# Altium schematic sheet power_supply.SchDoc
size A2
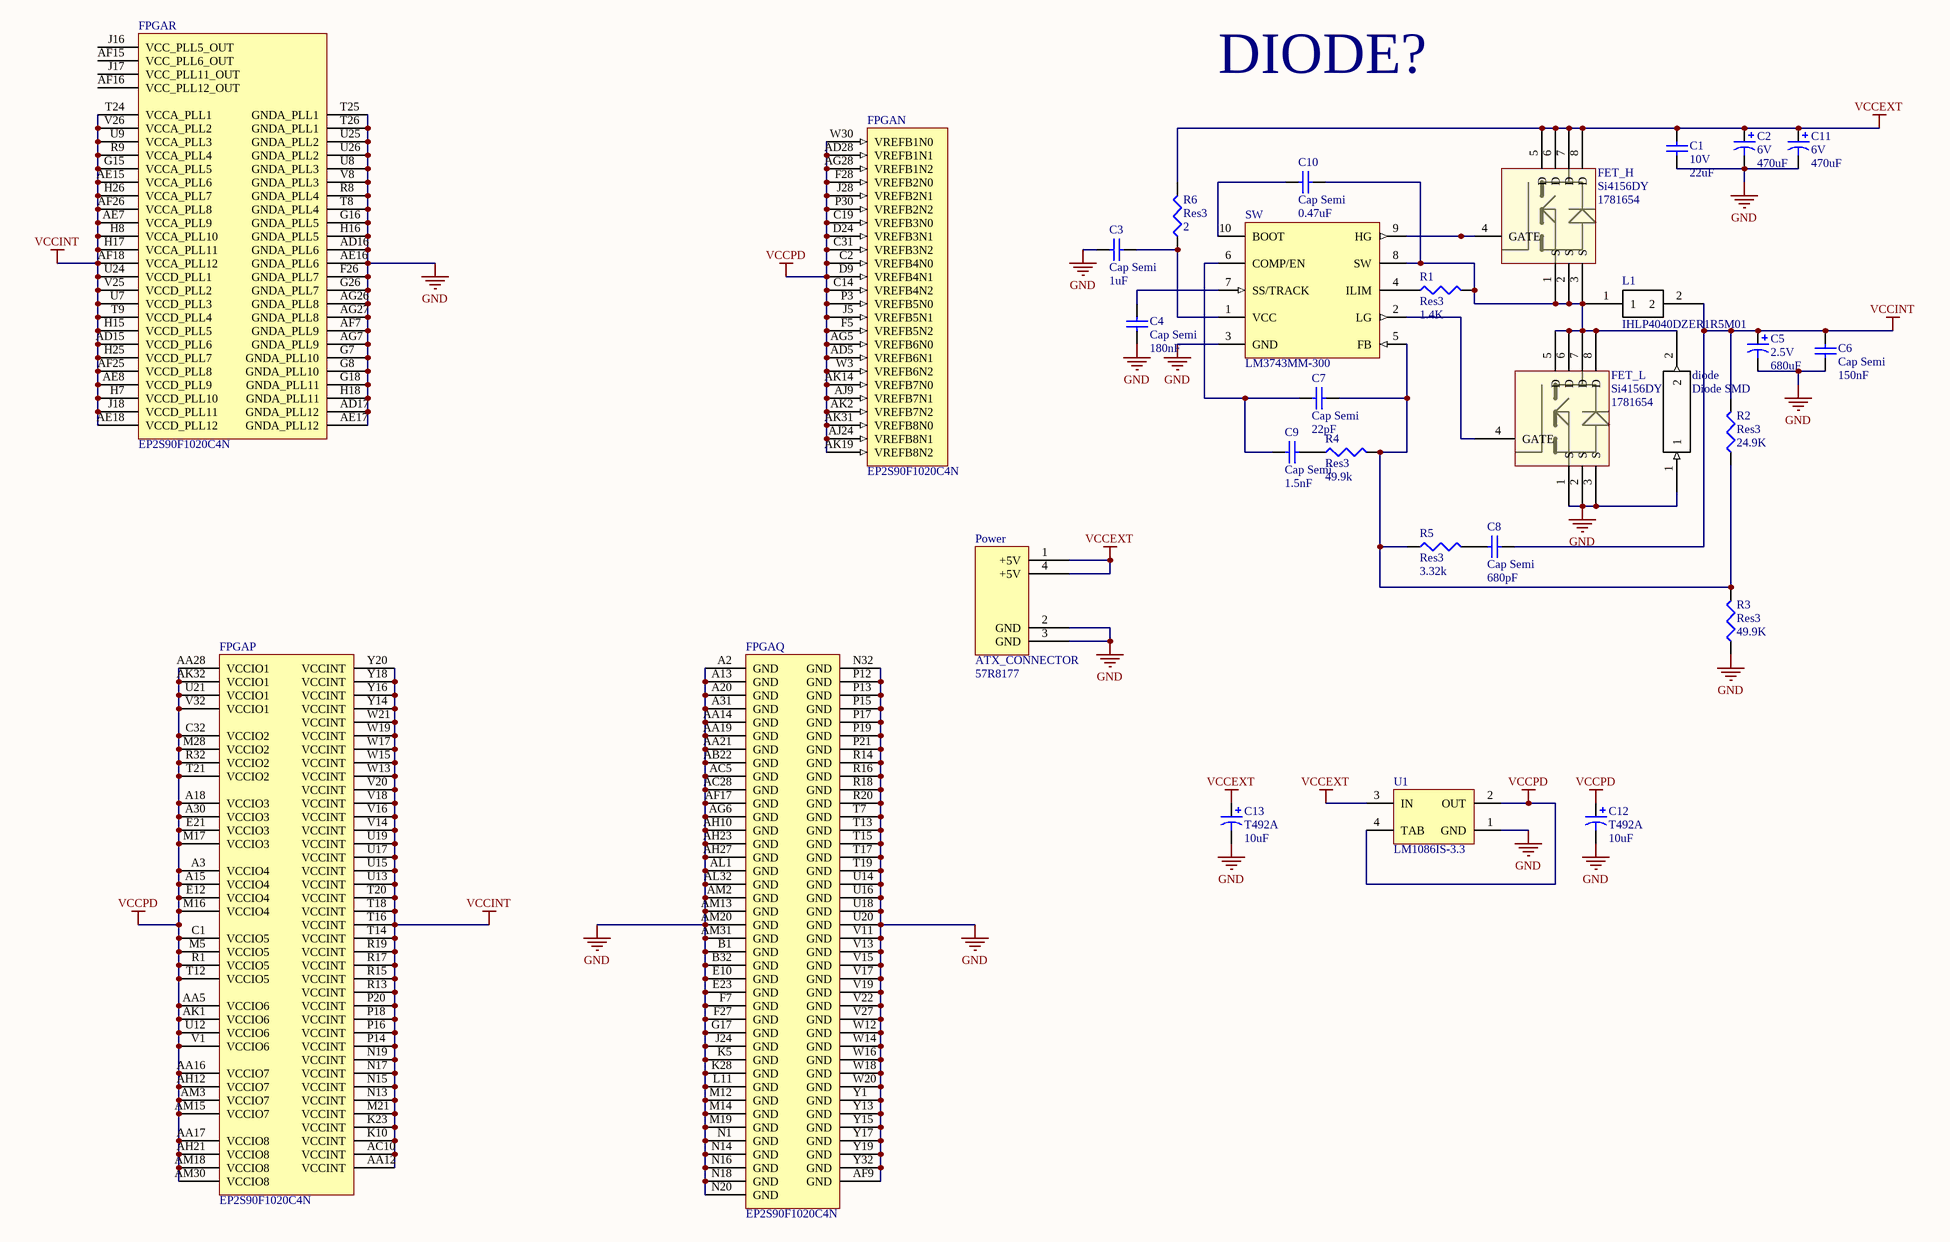
[diagram p0: power_supply.SchDoc]

## Parts
C1  10V  value 22uF  [CAPC3225L]
C2  6V  value 470uF  [E]
C3  Cap Semi  value 1uF  [2012[0805]]
C4  Cap Semi  value 180nF  [2012[0805]]
C5  2.5V  value 680uF  [E]
C6  Cap Semi  value 150nF  [2012[0805]]
C7  Cap Semi  value 22pF  [CAPC1608L]
C8  Cap Semi  value 680pF  [CAPC1608L]
C9  Cap Semi  value 1.5nF  [CAPC1608L]
C10  Cap Semi  value 0.47uF  [2012[0805]]
C11  6V  value 470uF  [E]
C12  T492A  value 10uF  [A]
C13  T492A  value 10uF  [A]
diode  Diode SMD  [Diode SMD]
FET_H  Si4156DY  Supplier Part Number 1: 1781654  [SO-8C_M]
FET_L  Si4156DY  Supplier Part Number 1: 1781654  [SO-8C_M]
FPGA  EP2S90F1020C4N  [FBGA1020]  (parts N,P,Q,R of 18)
L1  IHLP4040DZER1R5M01  [IHLP4040DZER1R5M01]
Power  ATX_CONNECTOR  Supplier Part Number 1: 57R8177  [Molex 8981]
R1  Res3  value 1.4K  [RESC1608L]
R2  Res3  value 24.9K  [RESC1608L]
R3  Res3  value 49.9K  [RESC1608L]
R4  Res3  value 49.9k  [RESC1608L]
R5  Res3  value 3.32k  [RESC1608L]
R6  Res3  value 2  [RESC1608L]
SW  LM3743MM-300  [MUB10A_N]
U1  LM1086IS-3.3  [TS3B_N]

## Nets
GND: C1.2 C2.2 C3.2 C4.1 C5.2 C6.1 C11.2 C12.2 C13.2 diode.1 FET_L.1(S) FET_L.2(S) FET_L.3(S) FPGA.A2(GND) FPGA.A13(GND) FPGA.A20(GND) FPGA.A31(GND) FPGA.AA14(GND) FPGA.AA19(GND) FPGA.AA21(GND) FPGA.AB22(GND) FPGA.AC5(GND) FPGA.AC28(GND) FPGA.AD16(GNDA_PLL6) FPGA.AD17(GNDA_PLL12) FPGA.AE16(GNDA_PLL6) FPGA.AE17(GNDA_PLL12) FPGA.AF7(GNDA_PLL9) FPGA.AF9(GND) FPGA.AF17(GND) FPGA.AG6(GND) FPGA.AG7(GNDA_PLL9) FPGA.AG26(GNDA_PLL8) FPGA.AG27(GNDA_PLL8) FPGA.AH10(GND) FPGA.AH23(GND) FPGA.AH27(GND) FPGA.AL1(GND) FPGA.AL32(GND) FPGA.AM2(GND) FPGA.AM13(GND) FPGA.AM20(GND) FPGA.AM31(GND) FPGA.B1(GND) FPGA.B32(GND) FPGA.E10(GND) FPGA.E23(GND) FPGA.F7(GND) FPGA.F26(GNDA_PLL7) FPGA.F27(GND) FPGA.G7(GNDA_PLL10) FPGA.G8(GNDA_PLL10) FPGA.G16(GNDA_PLL5) FPGA.G17(GND) FPGA.G18(GNDA_PLL11) FPGA.G26(GNDA_PLL7) FPGA.H16(GNDA_PLL5) FPGA.H18(GNDA_PLL11) FPGA.J24(GND) FPGA.K5(GND) FPGA.K28(GND) FPGA.L11(GND) FPGA.M12(GND) FPGA.M14(GND) FPGA.M19(GND) FPGA.N1(GND) FPGA.N14(GND) FPGA.N16(GND) FPGA.N18(GND) FPGA.N20(GND) FPGA.N32(GND) FPGA.P12(GND) FPGA.P13(GND) FPGA.P15(GND) FPGA.P17(GND) FPGA.P19(GND) FPGA.P21(GND) FPGA.R8(GNDA_PLL4) FPGA.R14(GND) FPGA.R16(GND) FPGA.R18(GND) FPGA.R20(GND) FPGA.T7(GND) FPGA.T8(GNDA_PLL4) FPGA.T13(GND) FPGA.T15(GND) FPGA.T17(GND) FPGA.T19(GND) FPGA.T25(GNDA_PLL1) FPGA.T26(GNDA_PLL1) FPGA.U8(GNDA_PLL3) FPGA.U14(GND) FPGA.U16(GND) FPGA.U18(GND) FPGA.U20(GND) FPGA.U25(GNDA_PLL2) FPGA.U26(GNDA_PLL2) FPGA.V8(GNDA_PLL3) FPGA.V11(GND) FPGA.V13(GND) FPGA.V15(GND) FPGA.V17(GND) FPGA.V19(GND) FPGA.V22(GND) FPGA.V27(GND) FPGA.W12(GND) FPGA.W14(GND) FPGA.W16(GND) FPGA.W18(GND) FPGA.W20(GND) FPGA.Y1(GND) FPGA.Y13(GND) FPGA.Y15(GND) FPGA.Y17(GND) FPGA.Y19(GND) FPGA.Y32(GND) Power.2(GND) Power.3(GND) R3.1 SW.3(GND) U1.1(GND)
VCCEXT: C1.1 C2.1 C11.1 C13.1 FET_H.5(D) FET_H.6(D) FET_H.7(D) FET_H.8(D) Power.1(+5V) Power.4(+5V) R6.2 U1.3(IN)
VCCINT: C5.1 C6.2 C8.1 FPGA.AA12(VCCINT) FPGA.AC10(VCCINT) FPGA.AD15(VCCD_PLL6) FPGA.AE7(VCCA_PLL9) FPGA.AE8(VCCD_PLL9) FPGA.AE15(VCCA_PLL6) FPGA.AE18(VCCD_PLL12) FPGA.AF18(VCCA_PLL12) FPGA.AF25(VCCD_PLL8) FPGA.AF26(VCCA_PLL8) FPGA.G15(VCCA_PLL5) FPGA.H7(VCCD_PLL10) FPGA.H8(VCCA_PLL10) FPGA.H15(VCCD_PLL5) FPGA.H17(VCCA_PLL11) FPGA.H25(VCCD_PLL7) FPGA.H26(VCCA_PLL7) FPGA.J18(VCCD_PLL11) FPGA.K10(VCCINT) FPGA.K23(VCCINT) FPGA.M21(VCCINT) FPGA.N13(VCCINT) FPGA.N15(VCCINT) FPGA.N17(VCCINT) FPGA.N19(VCCINT) FPGA.P14(VCCINT) FPGA.P16(VCCINT) FPGA.P18(VCCINT) FPGA.P20(VCCINT) FPGA.R9(VCCA_PLL4) FPGA.R13(VCCINT) FPGA.R15(VCCINT) FPGA.R17(VCCINT) FPGA.R19(VCCINT) FPGA.T9(VCCD_PLL4) FPGA.T14(VCCINT) FPGA.T16(VCCINT) FPGA.T18(VCCINT) FPGA.T20(VCCINT) FPGA.T24(VCCA_PLL1) FPGA.U7(VCCD_PLL3) FPGA.U9(VCCA_PLL3) FPGA.U13(VCCINT) FPGA.U15(VCCINT) FPGA.U17(VCCINT) FPGA.U19(VCCINT) FPGA.U24(VCCD_PLL1) FPGA.V14(VCCINT) FPGA.V16(VCCINT) FPGA.V18(VCCINT) FPGA.V20(VCCINT) FPGA.V25(VCCD_PLL2) FPGA.V26(VCCA_PLL2) FPGA.W13(VCCINT) FPGA.W15(VCCINT) FPGA.W17(VCCINT) FPGA.W19(VCCINT) FPGA.W21(VCCINT) FPGA.Y14(VCCINT) FPGA.Y16(VCCINT) FPGA.Y18(VCCINT) FPGA.Y20(VCCINT) L1.2 R2.2
VCCPD: C12.1 FPGA.A3(VCCIO4) FPGA.A15(VCCIO4) FPGA.A18(VCCIO3) FPGA.A30(VCCIO3) FPGA.AA5(VCCIO6) FPGA.AA16(VCCIO7) FPGA.AA17(VCCIO8) FPGA.AA28(VCCIO1) FPGA.AD5(VREFB6N1) FPGA.AD28(VREFB1N1) FPGA.AG5(VREFB6N0) FPGA.AG28(VREFB1N2) FPGA.AH12(VCCIO7) FPGA.AH21(VCCIO8) FPGA.AJ9(VREFB7N1) FPGA.AJ24(VREFB8N1) FPGA.AK1(VCCIO6) FPGA.AK2(VREFB7N2) FPGA.AK14(VREFB7N0) FPGA.AK19(VREFB8N2) FPGA.AK31(VREFB8N0) FPGA.AK32(VCCIO1) FPGA.AM3(VCCIO7) FPGA.AM15(VCCIO7) FPGA.AM18(VCCIO8) FPGA.AM30(VCCIO8) FPGA.C1(VCCIO5) FPGA.C2(VREFB4N0) FPGA.C14(VREFB4N2) FPGA.C19(VREFB3N0) FPGA.C31(VREFB3N2) FPGA.C32(VCCIO2) FPGA.D9(VREFB4N1) FPGA.D24(VREFB3N1) FPGA.E12(VCCIO4) FPGA.E21(VCCIO3) FPGA.F5(VREFB5N2) FPGA.F28(VREFB2N0) FPGA.J5(VREFB5N1) FPGA.J28(VREFB2N1) FPGA.M5(VCCIO5) FPGA.M16(VCCIO4) FPGA.M17(VCCIO3) FPGA.M28(VCCIO2) FPGA.P3(VREFB5N0) FPGA.P30(VREFB2N2) FPGA.R1(VCCIO5) FPGA.R32(VCCIO2) FPGA.T12(VCCIO5) FPGA.T21(VCCIO2) FPGA.U12(VCCIO6) FPGA.U21(VCCIO1) FPGA.V1(VCCIO6) FPGA.V32(VCCIO1) FPGA.W3(VREFB6N2) FPGA.W30(VREFB1N0) U1.2(OUT) U1.4(TAB)
NetC3_1: C3.1 R6.1 SW.1(VCC)
NetC4_2: C4.2 SW.7(SS/TRACK)
NetC7_1: C7.1 R2.1 R3.2 R4.2 R5.1 SW.5(FB)
NetC7_2: C7.2 C9.2 SW.6(COMP/EN)
NetC8_2: C8.2 R5.2
NetC9_1: C9.1 R4.1
NetC10_1: C10.1 diode.2 FET_H.1(S) FET_H.2(S) FET_H.3(S) FET_L.5(D) FET_L.6(D) FET_L.7(D) FET_L.8(D) L1.1 R1.2 SW.8(SW)
NetC10_2: C10.2 SW.10(BOOT)
NetFET_H_4: FET_H.4(GATE) SW.9(HG)
NetFET_L_4: FET_L.4(GATE) SW.2(LG)
NetR1_1: R1.1 SW.4(ILIM)

Not connected (* = marked no-connect by the designer): FPGA AF15(VCC_PLL6_OUT) AF16(VCC_PLL12_OUT) J16(VCC_PLL5_OUT) J17(VCC_PLL11_OUT)

## Notes on the sheet
- DIODE?

## Library data of the parts
C1 C3 C4 C6-C10 = Cap Semi: Capacitor (Semiconductor SIM Model); Published: 8-Jun-2000; LatestRevisionDate: 29-May-2009; LatestRevisionNote: IPC-7351 Footprint Added.; PackageReference: C1206; Publisher: Altium Limited; PackageDescription: Chip Capacitor
C2 C5 C11 = Cap Pol3: Polarized Capacitor (Surface Mount); Published: 8-Jun-2000; LatestRevisionDate: 29-May-2009; LatestRevisionNote: IPC-7351 Footprint Added.; PackageReference: C0805; Publisher: Altium Limited; PackageDescription: Chip Capacitor
C12 C13 = T492A: Solid Tantalum Chip Capacitor, T492 Series - CWR11 Style Per Mil-PRF-55365/8; Published: 17-Jul-2002; LatestRevisionDate: 19-Mar-2004; LatestRevisionNote: Silkscreen dimensions re-sized.; DatasheetDocument: Mar-2001; PackageDocument: Mar-2001; PackageReference: A; Publisher: Altium Limited; Code_JEITA: 3216-18; ComponentLink1Description: Manufacturer Link; ComponentLink1URL: http://www.kemet.com/; ComponentLink2Description: Datasheet; ComponentLink2URL: http://www.kemet.com/kemet/web/homepage/kechome.nsf/vapubfilesname/F3102TA.pdf/$file/F3102TA.pdf
FPGA = EP2S90F1020C4N: Stratix II 1.2V FPGA, 758 I/Os, 1020-Pin FineLine BGA, Speed Grade 4, Commercial Grade, Pb-Free; Note: DQS signal pins in banks 3, 4, 7 & 8 named according to DQ bus modes. "/" separates each mode. ie. Mode x4, x8/x9, x16/x18 and x32/x36.; Published: 8-Jul-2005; LatestRevisionDate: 13-Apr-2006; LatestRevisionNote: IPC-7351 Footprint Added.; DatasheetVersion: ver4.3, Jan-2008; PackageVersion: ver15.1, May-2008; PackageReference: FBGA1020; Publisher: Altium Limited; PackageDescription: 1020-Ball FineLine Ball Grid Array (FBGA1020) - Flip Chip; Code_JEDEC: MS-034-AAP-1; ComponentLink1Description: Manufacturer Link; ComponentLink1URL: http://www.altera.com/products/devices/stratix2/st2-index.jsp; ComponentLink2Description: Handbook; ComponentLink2URL: http://www.altera.com/literature/hb/stx2/stratix2_handbook.pdf; ComponentLink3Description: Packaging Specification; ComponentLink3URL: http://www.altera.com/literature/ds/dspkg.pdf
R1-R6 = Res3: Resistor; Published: 8-Jun-2000; LatestRevisionDate: 29-May-2009; LatestRevisionNote: IPC-7351 Footprint Added.; PackageReference: J1-0603; Publisher: Altium Limited; PackageDescription: Chip Resistor
SW = LM3743MM-300: High-Performance Synchronous Buck Controller with Comprehensive Fault Protection Features; Manufacturer: National Semiconductor; CompType: Switcher; PackageTopMarking: ZXTT*SKPB; PowerWise: Y; Published: 4-Dec-2008; DatasheetVersion: Oct-2008; PackageVersion: revB, Jul-2003; PackageReference: MUB10A; Publisher: Altium Limited; PackageDescription: Mini-SO, Molded, .118 x .118 x .034in Body, 10 Lead, .0197in Pitch; PartNumber: LM3743MM-300; RoHS: Y; PinCount: 10; DigiKeyPartNumber: LM3743MM-300CT-ND; Code_JEDEC: MO-187-BA; ComponentLink1Description: LM3743 Datasheet; ComponentLink1URL: http://www.national.com/ds/LM/LM3743.pdf; ComponentLink2Description: LM3743 Web Page; ComponentLink2URL: http://www.national.com/pf/LM/LM3743.html; ComponentLink3Description: MUB10A Package Page; ComponentLink3URL: http://www.national.com/packaging/folders/mub10a.html
U1 = LM1086IS-3.3: 1.5A Low Dropout Positive Regulators; Manufacturer: National Semiconductor; CompType: LDO IC; PackageTopMarking: NSUZXYTTE#*LM1086*IS-3.3; PowerWise: N; Published: 4-Dec-2008; DatasheetVersion: Jun-2005; PackageVersion: revF, Apr-2005; PackageReference: TS3B; Publisher: Altium Limited; PackageDescription: TO-263, Molded, .400 x .390 x .180in, 3 Lead, .1in Pitch, Surface Mount; PartNumber: LM1086IS-3.3; RoHS: O; PinCount: 3; DigiKeyPartNumber: LM1086IS-3.3-ND; Code_JEDEC: MO-169-AA; ComponentLink1Description: LM1086 Datasheet; ComponentLink1URL: http://www.national.com/ds/LM/LM1086.pdf; ComponentLink2Description: LM1086 Web Page; ComponentLink2URL: http://www.national.com/pf/LM/LM1086.html; ComponentLink3Description: TS3B Package Page; ComponentLink3URL: http://www.national.com/packaging/folders/ts3b.html
FET_H FET_L = Si4156DY: Supplier 1: Farnell
Power = ATX_CONNECTOR: Supplier 1: Newark